# EAGLE design optocopler_adapter (EAGLE 9.0.1)
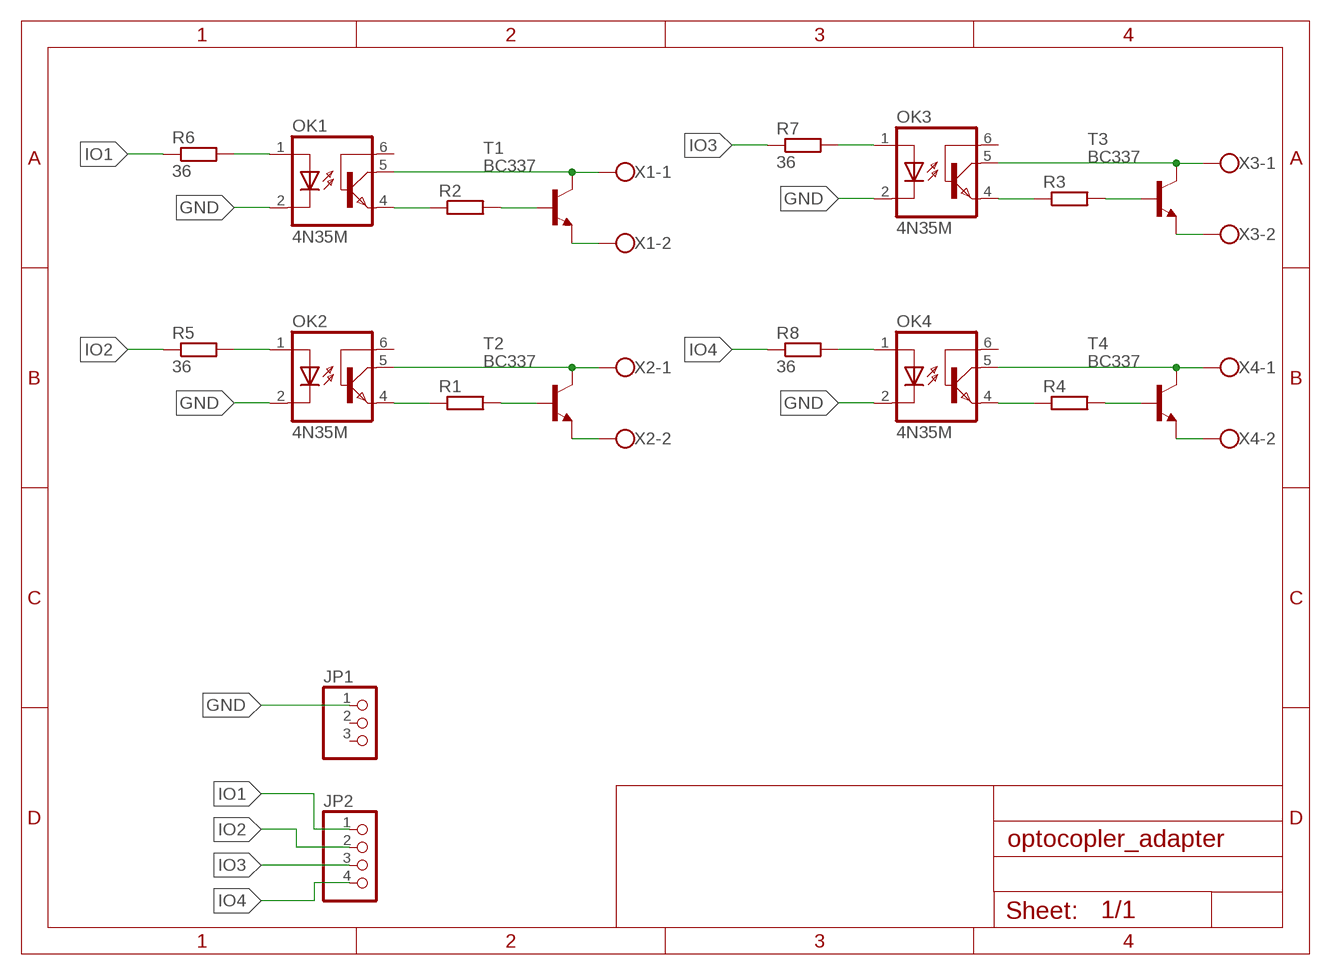
[diagram p0: schematic, sheet 1]

## Parts
JP1  PINHD-1X3/90  [1X03/90]
JP2  PINHD-1X4/90  [1X04/90]
OK1  4N35M  [DIL06]
OK2  4N35M  [DIL06]
OK3  4N35M  [DIL06]
OK4  4N35M  [DIL06]
R1  R-EU_0204/7  [0204/7]
R2  R-EU_0204/7  [0204/7]
R3  R-EU_0204/7  [0204/7]
R4  R-EU_0204/7  [0204/7]
R5  36  R-EU_0204/7  [0204/7]
R6  36  R-EU_0204/7  [0204/7]
R7  36  R-EU_0204/7  [0204/7]
R8  36  R-EU_0204/7  [0204/7]
T1  BC337  -NPN-TO92  [TO92]
T2  BC337  -NPN-TO92  [TO92]
T3  BC337  -NPN-TO92  [TO92]
T4  BC337  -NPN-TO92  [TO92]
X1  W237-102  [W237-102]
X2  W237-102  [W237-102]
X3  W237-102  [W237-102]
X4  W237-102  [W237-102]

## Nets
GND: JP1.1 OK1.2(C) OK2.2(C) OK3.2(C) OK4.2(C)
IO1: JP2.1 R6.1
IO2: JP2.2 R5.1
IO3: JP2.3 R7.1
IO4: JP2.4 R8.1
N$1: OK1.1(A) R6.2
N$2: OK1.4(EMI) R2.1
N$4: R2.2 T1.2(B)
N$5: OK1.5(COL) T1.3(C) X1.1
N$6: T1.1(E) X1.2
N$7: OK2.1(A) R5.2
N$8: OK2.4(EMI) R1.1
N$9: R1.2 T2.2(B)
N$10: OK2.5(COL) T2.3(C) X2.1
N$11: T2.1(E) X2.2
N$12: OK3.1(A) R7.2
N$13: OK3.4(EMI) R3.1
N$14: R3.2 T3.2(B)
N$15: OK3.5(COL) T3.3(C) X3.1
N$16: T3.1(E) X3.2
N$17: OK4.1(A) R8.2
N$18: OK4.4(EMI) R4.1
N$19: R4.2 T4.2(B)
N$20: OK4.5(COL) T4.3(C) X4.1
N$21: T4.1(E) X4.2
Unconnected: JP1.2 JP1.3 OK1.6(BAS) OK2.6(BAS) OK3.6(BAS) OK4.6(BAS)

## Library data of the parts
JP1 = pinhead:PINHD-1X3: PIN HEADER
JP2 = pinhead:PINHD-1X4: PIN HEADER
OK1-OK4 = optocoupler:4N*?M: General Purpose 6-Pin Phototransistor Optocouplers Source: http://www.fairchildsemi.com/ds/4N/4N35-M.pdf; MPN: 4N35-M; OC_FARNELL: 1021351; OC_NEWARK: 98K9114
R1-R8 = resistor:R-EU_: RESISTOR, European symbol
T1-T4 = transistor:*-NPN-: NPN Transistror BF959 corrected 2008.03.06
X1-X4 = con-wago-500:W237-102: WAGO SCREW CLAMP; MPN: 237-102; OC_FARNELL: unknown; OC_NEWARK: 70K9898

## Board
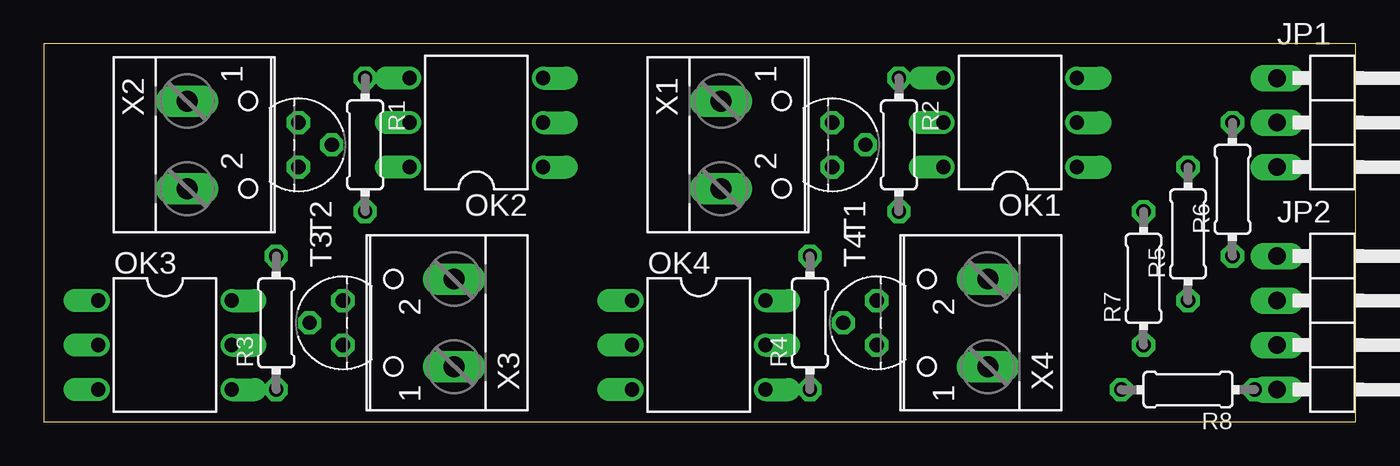
[diagram p1: board, top side]
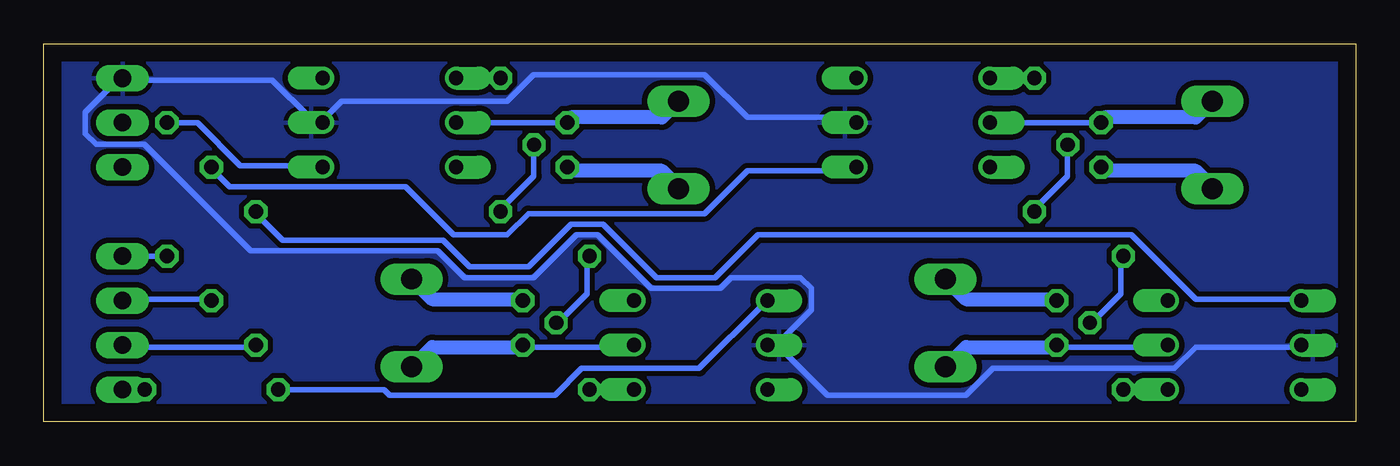
[diagram p2: board, bottom side, seen from below]

Size 74.92 x 21.58 mm. Coordinates in mm from the lower left corner, seen from the top.
Outline: 0,0 74.92,0 74.92,21.58 0,21.58 0,0
Copper layers (1*16): Top 0.035mm / dielectric 1.5mm / Bottom 0.035mm
Design rules "default *": minimum track width 12mil, minimum drill 0.35mm, track to track 12mil, track to pad 12mil, pad to pad 12mil, via to via 12mil, smd to smd 6mil, copper to edge 40mil, drill to drill 6mil, minimum pad ring 10mil, minimum via ring 8mil, stop-mask expansion 4mil, vias tented up to drill 0mil, thermal gap 10mil

### Footprints (pad centres in the part's own frame; a part is rotated, then mirrored left to right if it is on the bottom)
1X03/90 = drill 1.016 long: 1 -2.54,-3.81; 2 0,-3.81; 3 2.54,-3.81
1X04/90 = drill 1.016 long: 1 -3.81,-3.81; 2 -1.27,-3.81; 3 1.27,-3.81; 4 3.81,-3.81
DIL06 = drill 0.813 offset: 1 -2.54,-3.81; 2 0,-3.81; 3 2.54,-3.81; 4 2.54,3.81; 5 0,3.81; 6 -2.54,3.81
0204/7 = drill 0.813 octagon: 1 -3.81,0; 2 3.81,0
TO92 = drill 0.813 octagon: 1 1.27,0; 2 0,1.905; 3 -1.27,0
W237-102 = drill 1.194 long: 1 -2.5,-1.27; 2 2.5,-1.27

### Placement (x,y rotation side)
JP1  74.23,17.08 270 top
JP2  74.23,5.65 270 top
OK1  55.18,17.08 90 top
OK2  24.7,17.08 90 top
OK3  6.92,4.38 270 top
OK4  37.4,4.38 270 top
R1  18.35,15.81 270 top
R2  48.83,15.81 270 top
R3  13.27,5.65 90 top
R4  43.75,5.65 90 top
R5  65.34,10.73 90 top
R6  67.88,13.27 90 top
R7  62.8,8.19 90 top
R8  65.34,1.84 180 top
T1  45.02,15.81 270 top
T2  14.54,15.81 270 top
T3  17.08,5.65 90 top
T4  47.56,5.65 90 top
X1  39.94,15.81 270 top
X2  9.46,15.81 270 top
X3  22.16,5.65 90 top
X4  52.64,5.65 90 top

### Tracks (layer width: path | path; a pad name or v marks a point on that pad's centre or on a via)
GND
  Bottom 0.305: OK3.2 3.35,4.27 9.14,4.27 10.36,3.05 20.73,3.05 22.25,1.52 30.18,1.52 32.92,4.27 33.53,4.27 OK4.2 33.53,4.57 32.92,4.57 31.09,6.4 31.09,7.62 31.7,8.23 35.66,8.23 36.27,7.62 40.23,7.62 43.28,10.67 44.5,10.67 46.94,8.23 50.9,8.23 52.43,9.75 63.09,9.75 69.19,15.85 71.93,15.85 72.54,16.46 72.54,17.68 70.71,19.51 JP1.1 70.41,19.51 61.87,19.51 59.74,17.37 59.13,17.37 OK1.2 58.83,17.37 57.91,18.29 48.46,18.29 46.94,19.81 37.19,19.81 34.75,17.37 28.65,17.37 OK2.2
  pour Bottom: 0,21.59 74.93,21.59 74.93,0 0,0
IO1
  Bottom 0.305: R6.1 67.97,9.45 JP2.1
IO2
  Bottom 0.305: R5.1 65.53,7.01 70.41,7.01 JP2.2
IO3
  Bottom 0.305: R7.1 63.09,4.27 70.41,4.27 JP2.3
IO4
  Bottom 0.305: R8.1 69.19,1.83 70.41,1.83 JP2.4
N$1
  Bottom 0.305: OK1.1 59.13,14.63 63.7,14.63 66.14,17.07 67.67,17.07 R6.2
N$2
  Bottom 0.305: R2.1 49.07,19.51 51.21,19.51 OK1.4
N$4
  Bottom 0.305: T1.2 46.94,15.54 46.94,14.02 48.77,12.19 R2.2
N$5
  Bottom 0.305: 44.81,17.37 T1.3 45.11,17.07 51.21,17.07 OK1.5 | 38.71,18.29 X1.1
  Bottom 0.813: 44.81,17.37 39.62,17.37 38.71,18.29
N$6
  Bottom 0.305: 44.81,14.33 T1.1 | 38.71,13.41 X1.2
  Bottom 0.813: 44.81,14.33 39.62,14.33 38.71,13.41
N$7
  Bottom 0.305: OK2.1 28.65,14.33 34.75,14.33 37.19,11.89 47.24,11.89 48.46,10.67 51.51,10.67 54.25,13.41 64.31,13.41 65.23,14.33 R5.2
N$8
  Bottom 0.305: R1.1 18.59,19.51 20.73,19.51 OK2.4
N$9
  Bottom 0.305: T2.2 16.46,15.54 16.46,14.02 18.29,12.19 R1.2
N$10
  Bottom 0.305: 14.33,17.37 T2.3 14.63,17.07 20.73,17.07 OK2.5 | 8.23,18.29 X2.1
  Bottom 0.813: 14.33,17.37 9.14,17.37 8.23,18.29
N$11
  Bottom 0.305: 14.33,14.33 T2.1 | 8.23,13.41 X2.2
  Bottom 0.813: 14.33,14.33 9.14,14.33 8.23,13.41
N$12
  Bottom 0.305: OK3.1 3.35,7.01 9.14,7.01 12.8,10.67 34.14,10.67 36.58,8.23 39.93,8.23 42.98,11.28 44.81,11.28 47.24,8.84 50.6,8.84 52.12,10.36 61.27,10.36 62.79,11.89 R7.2
N$13
  Bottom 0.305: OK3.4 10.97,1.83 13.11,1.83 R3.1
N$14
  Bottom 0.305: R3.2 13.41,9.45 13.41,7.32 14.94,5.79 T3.2
N$15
  Bottom 0.305: 17.37,4.27 T3.3 17.07,4.27 10.97,4.27 OK3.5 | 23.16,3.35 X3.1
  Bottom 0.813: 17.37,4.27 22.25,4.27 23.16,3.35
N$16
  Bottom 0.305: 17.37,7.01 T3.1 | 23.16,7.92 X3.2
  Bottom 0.813: 17.37,7.01 22.25,7.01 23.16,7.92
N$17
  Bottom 0.305: R8.2 61.27,1.83 55.47,1.83 55.17,1.52 45.72,1.52 44.2,3.05 37.49,3.05 33.83,6.71 OK4.1
N$18
  Bottom 0.305: OK4.4 41.45,1.83 43.59,1.83 R4.1
N$19
  Bottom 0.305: R4.2 43.89,9.45 43.89,7.32 45.41,5.79 T4.2
N$20
  Bottom 0.305: 47.85,4.27 T4.3 47.55,4.27 41.45,4.27 OK4.5 | 53.65,3.35 X4.1
  Bottom 0.813: 47.85,4.27 52.73,4.27 53.65,3.35
N$21
  Bottom 0.305: 47.85,7.01 T4.1 | 53.65,7.92 X4.2
  Bottom 0.813: 47.85,7.01 52.73,7.01 53.65,7.92